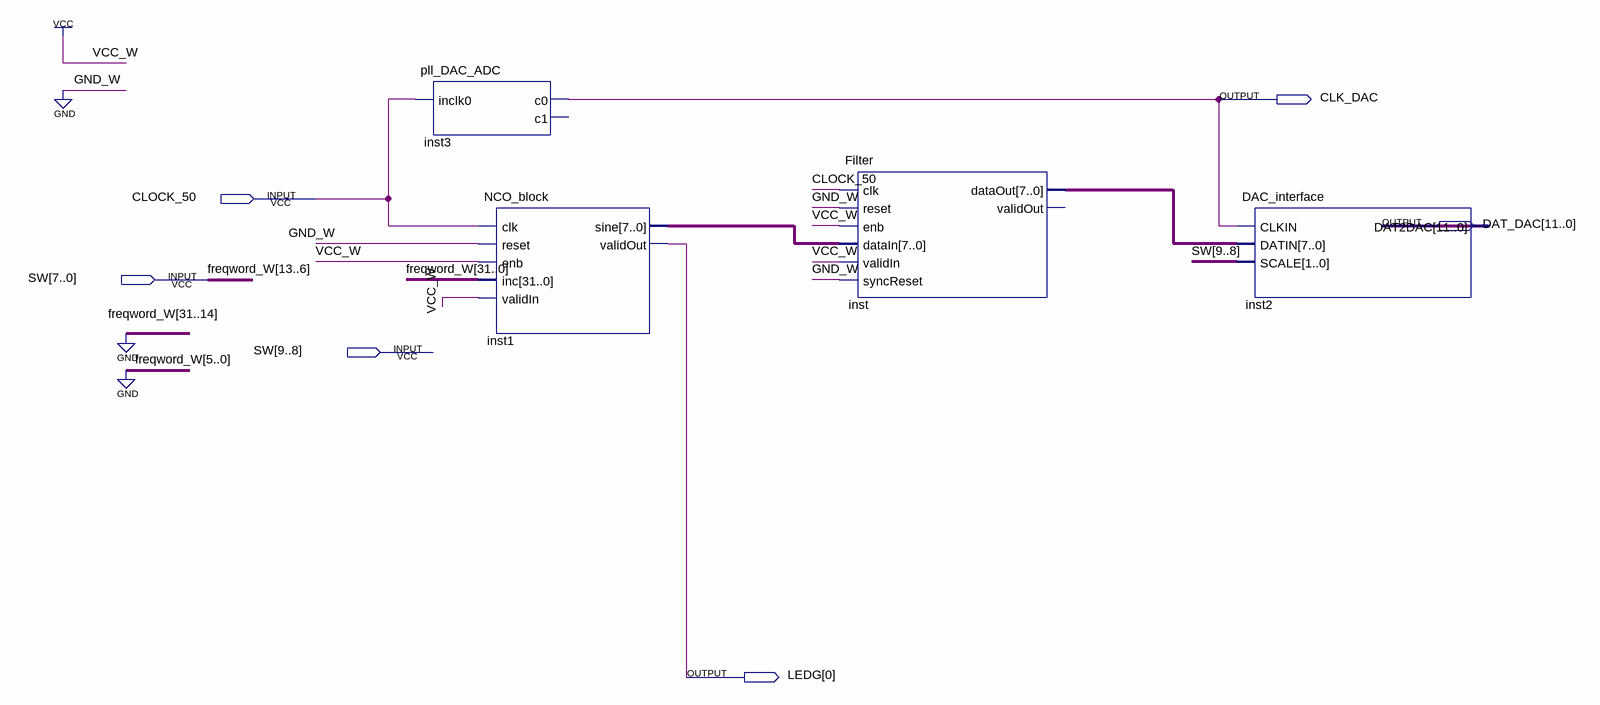
[diagram p0: schematic sheet]
// Quartus schematic NCO_quartus.bdf as structural Verilog: 4 symbols, 6 pins
module NCO_quartus (
  input  CLOCK_50,
  input  [9:0] SW,
  output CLK_DAC,
  output [11:0] DAT_DAC,
  output [0:0] LEDG
);

  wire [7:0] inst1_sine, inst_dataout;

  pll_DAC_ADC inst3 (.inclk0(CLOCK_50), .c0(CLK_DAC));  // open: c1
  NCO_block inst1 (
    .clk(CLOCK_50), .reset(1'b0), .enb(1'b1), .inc({{18{1'b0}}, SW[7:0], {6{1'b0}}}), .validIn(1'b1),
    .sine(inst1_sine), .validOut(LEDG[0]));
  Filter inst (
    .clk(CLOCK_50), .reset(1'b0), .enb(1'b1), .dataIn(inst1_sine), .validIn(1'b1), .syncReset(1'b0),
    .dataOut(inst_dataout));  // open: validOut
  DAC_interface inst2 (.CLKIN(CLK_DAC), .DATIN(inst_dataout), .SCALE(SW[9:8]), .DAT2DAC(DAT_DAC));

  // Other names for the same wires on the sheet: freqword_W[13:6] = SW[7:0]
endmodule
